# EAGLE design SERVOS-1 (EAGLE 7.2.0)
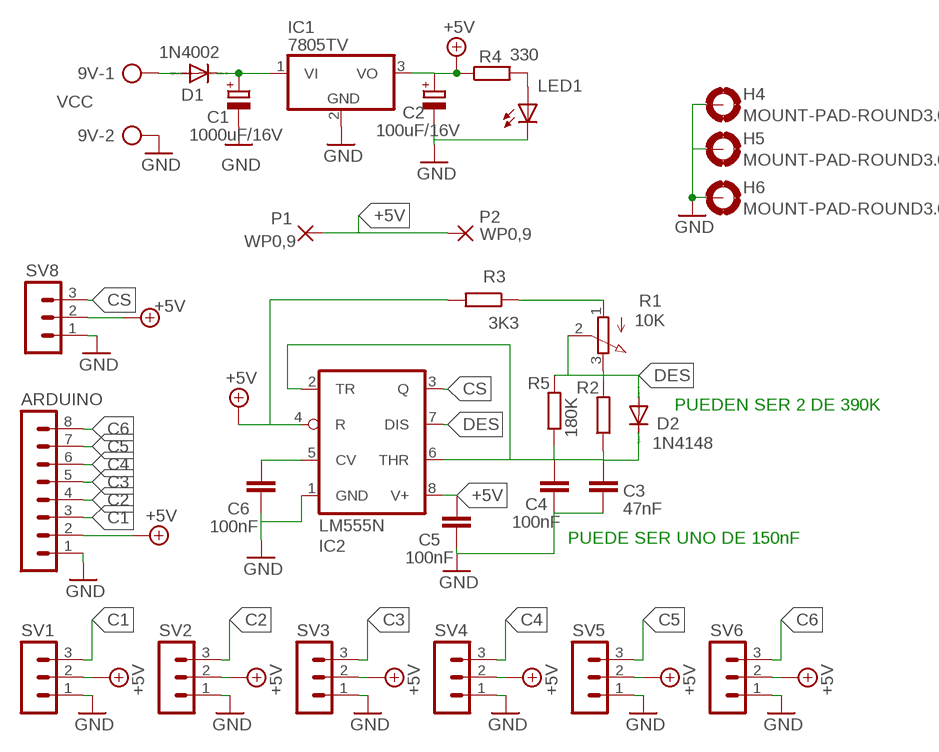
[diagram p0: schematic, sheet 1]

## Parts
9V  VCC  AK500/2  [AK500/2]
ARDUINO  MA08-1  [MA08-1]
C1  1000uF/16V  CPOL-EUE2.5-7  [E2,5-7]
C2  100uF/16V  CPOL-EUE2.5-5  [E2,5-5]
C3  47nF  C-EU050-025X075  [C050-025X075]
C4  100nF  C-EU050-025X075  [C050-025X075]
C5  100nF  C-EU050-025X075  [C050-025X075]
C6  100nF  C-EU050-025X075  [C050-025X075]
D1  1N4002  1N4148DO35-7  [DO35-7]
D2  1N4148  1N4148DO35-7  [DO35-7]
H4  MOUNT-PAD-ROUND3.0  [3,0-PAD]
H5  MOUNT-PAD-ROUND3.0  [3,0-PAD]
H6  MOUNT-PAD-ROUND3.0  [3,0-PAD]
IC1  7805TV  [TO220V]
IC2  LM555N  [DIL08]
LED1  LED3MM  [LED3MM]
P1  WP0,9  WIREPAD1,6/0,9  [1,6/0,9]
P2  WP0,9  WIREPAD1,6/0,9  [1,6/0,9]
R1  10K  3RP/1610N  [3RP/1610N]
R2  R-EU_0207/10  [0207/10]
R3  3K3  R-EU_0207/10  [0207/10]
R4  330  R-EU_0207/10  [0207/10]
R5  180K  R-EU_0207/10  [0207/10]
SV1  MA03-1  [MA03-1]
SV2  MA03-1  [MA03-1]
SV3  MA03-1  [MA03-1]
SV4  MA03-1  [MA03-1]
SV5  MA03-1  [MA03-1]
SV6  MA03-1  [MA03-1]
SV8  MA03-1  [MA03-1]

## Nets
+5V: ARDUINO.2 C2.+ C5.1 IC1.3(VO) IC2.4(R) IC2.8(V+) P1.1(P) P2.1(P) R3.2 R4.1 SV1.2 SV2.2 SV3.2 SV4.2 SV5.2 SV6.2 SV8.2
C1: ARDUINO.3 SV1.3
C2: ARDUINO.4 SV2.3
C3: ARDUINO.5 SV3.3
C4: ARDUINO.6 SV4.3
C5: ARDUINO.7 SV5.3
C6: ARDUINO.8 SV6.3
CS: IC2.3(Q) SV8.3
DES: D2.A IC2.7(DIS) R1.2(S) R1.3(E) R2.2 R5.2
GND: 9V.2 ARDUINO.1 C1.- C2.- C3.2 C4.2 C5.2 C6.2 H4.B3,0(MOUNT) H5.B3,0(MOUNT) H6.B3,0(MOUNT) IC1.2(GND) IC2.1(GND) LED1.K(C) SV1.1 SV2.1 SV3.1 SV4.1 SV5.1 SV6.1 SV8.1
N$1: C1.+ D1.C IC1.1(VI)
N$2: 9V.1 D1.A
N$3: LED1.A R4.2
N$7: C6.1 IC2.5(CV)
N$8: R1.1(A) R3.1
N$9: C3.1 C4.1 D2.C IC2.2(TR) IC2.6(THR) R2.1 R5.1

## Notes on the sheet
- PUEDEN SER 2 DE 390K
- PUEDE SER UNO DE 150nF

## Library data of the parts
9V = con-ptr500:AK500/2: CONNECTOR; OC_FARNELL: unknown; OC_NEWARK: unknown
ARDUINO = con-lstb:MA08-1: PIN HEADER; OC_FARNELL: unknown; OC_NEWARK: unknown
C1 C2 = rcl:CPOL-EU: POLARIZED CAPACITOR, European symbol
C3-C6 = rcl:C-EU: CAPACITOR, European symbol
D1 D2 = diode:1N4148: DIODE high speed (Philips)
H4-H6 = holes:MOUNT-PAD-ROUND: MOUNTING PAD, round
IC1 = linear:78*: Positive VOLTAGE REGULATOR Source: http://cache.national.com/ds/LM/LM78L05.pdf http://www.fairchildsemi.com/ds/LM/LM7805.pdf
IC2 = linear:*555: TIMER
LED1 = led:LED: LED OSRAM: - CHIPLED LG R971, LG N971, LY N971, LG Q971, LY Q971, LO R971, LY R971 LH N974, LH R974 LS Q976, LO Q976, LY Q976 LO Q996 - Hyper CHIPLED LW Q18S LB Q993, LB Q99A, LB R99A - SideLED LS A670, LO A670, LY A670, LG A670, LP A670 LB A673, LV A673, LT A673, LW A673 LH A674 LY A675 LS A676, LA A676, LO A676, LY A676, LW A676 LS A679, LY A679, LG A679 - Hyper Micro SIDELED® LS Y876, LA Y876, LO Y876, LY Y876 LT Y87S - SmartLED LW L88C, LW L88S LB L89C, LB L89S, LG L890 LS L89K, LO L89K, LY L89K LS L896, LA L896, LO L896, LY L896 - TOPLED LS T670, LO T670, LY T670, LG T670, LP T670 LSG T670, LSP T670, LSY T670, LOP T670, LYG T670 LG T671, LOG T671, LSG T671 LB T673, LV T673, LT T673, LW T673 LH T674 LS T676, LA T676, LO T676, LY T676, LB T676, LH T676, LSB T676, LW T676 LB T67C, LV T67C, LT T67C, LS T67K, LO T67K, LY T67K, LW E67C LS E67B, LA E67B, LO E67B, LY E67B, LB E67C, LV E67C, LT E67C LW T67C LS T679, LY T679, LG T679 LS T770, LO T770, LY T770, LG T770, LP T770 LB T773, LV T773, LT T773, LW T773 LH T774 LS E675, LA E675, LY E675, LS T675 LS T776, LA T776, LO T776, LY T776, LB T776 LHGB T686 LT T68C, LB T68C - Hyper Mini TOPLED® LB M676 - Mini TOPLED Santana® LG M470 LS M47K, LO M47K, LY M47K Source: http://www.osram.convergy.de LUXEON: - LUMILED® LXK2-PW12-R00, LXK2-PW12-S00, LXK2-PW14-U00, LXK2-PW14-V00 LXK2-PM12-R00, LXK2-PM12-S00, LXK2-PM14-U00 LXK2-PE12-Q00, LXK2-PE12-R00, LXK2-PE12-S00, LXK2-PE14-T00, LXK2-PE14-U00 LXK2-PB12-K00, LXK2-PB12-L00, LXK2-PB12-M00, LXK2-PB14-N00, LXK2-PB14-P00, LXK2-PB14-Q00 LXK2-PR12-L00, LXK2-PR12-M00, LXK2-PR14-Q00, LXK2-PR14-R00 LXK2-PD12-Q00, LXK2-PD12-R00, LXK2-PD12-S00 LXK2-PH12-R00, LXK2-PH12-S00 LXK2-PL12-P00, LXK2-PL12-Q00, LXK2-PL12-R00 Source: www.luxeon.com KINGBRIGHT: KA-3528ASYC Source: www.kingbright.com
P1 P2 = wirepad:WIREPAD: Wire PAD connect wire on PCB
R1 = pot:3RP/1610N: 16mm Potentiometer one level Source: http://www.alphapotentiometers.net/html/16mm_pot_2.html
R2-R5 = rcl:R-EU_: RESISTOR, European symbol
SV1-SV6 SV8 = con-lstb:MA03-1: PIN HEADER; OC_FARNELL: unknown; OC_NEWARK: unknown

## Board
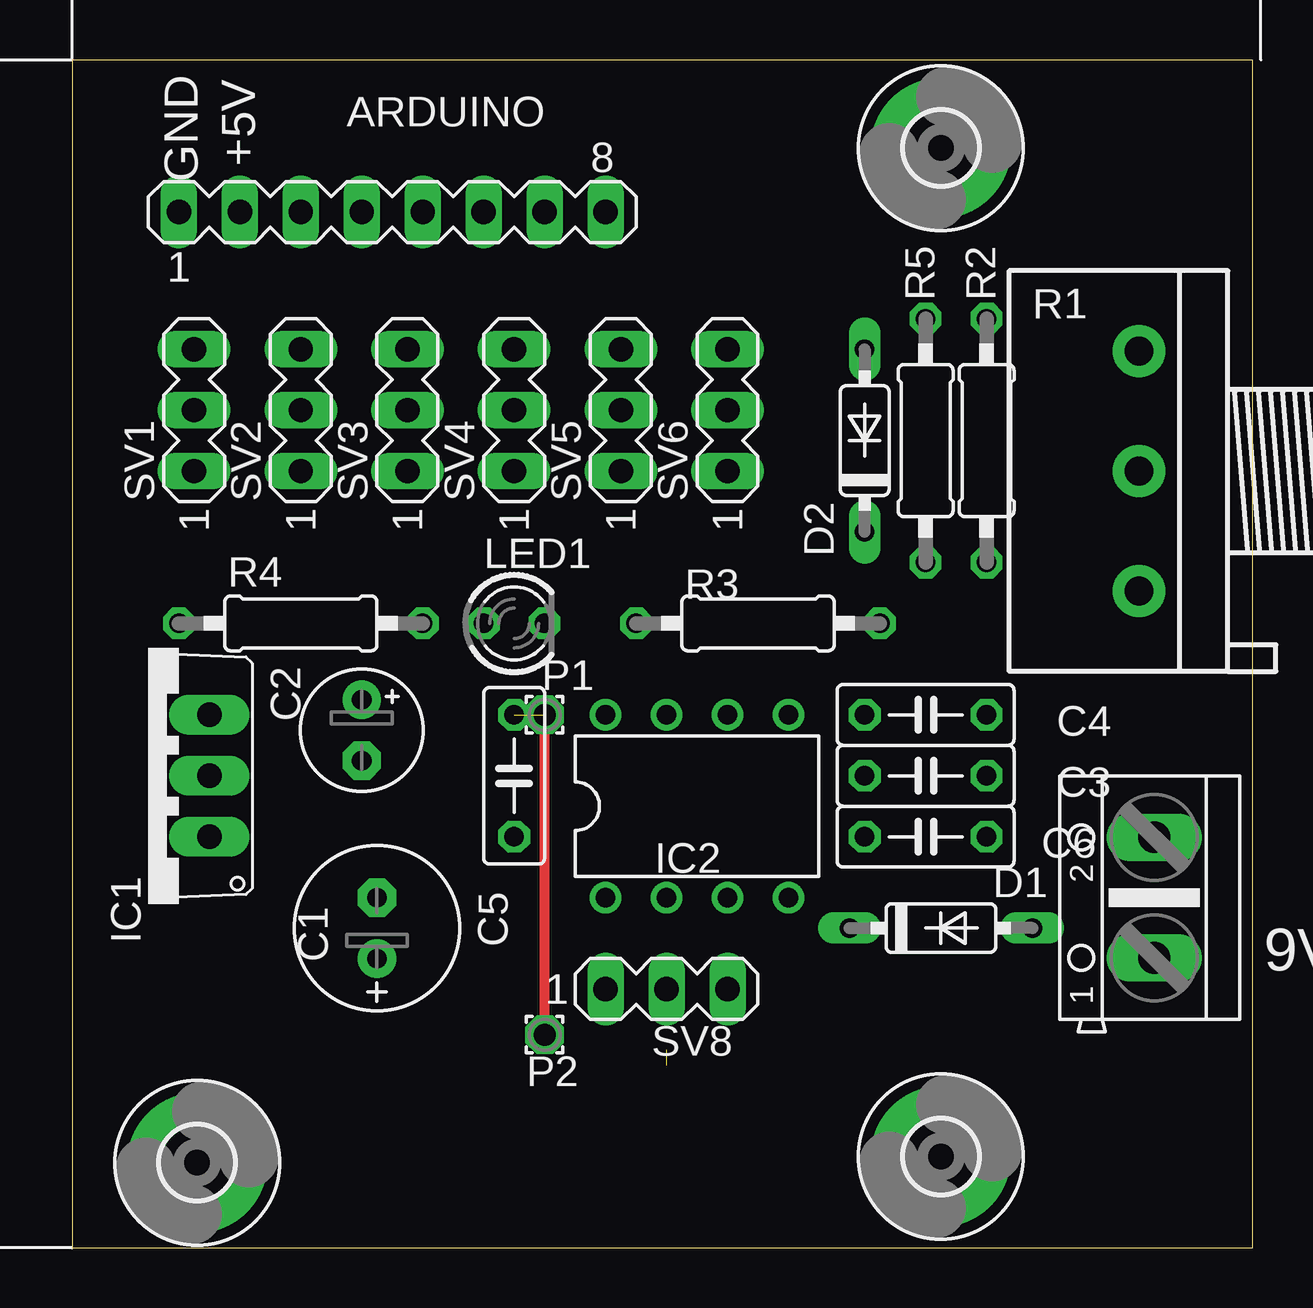
[diagram p1: board, top side]
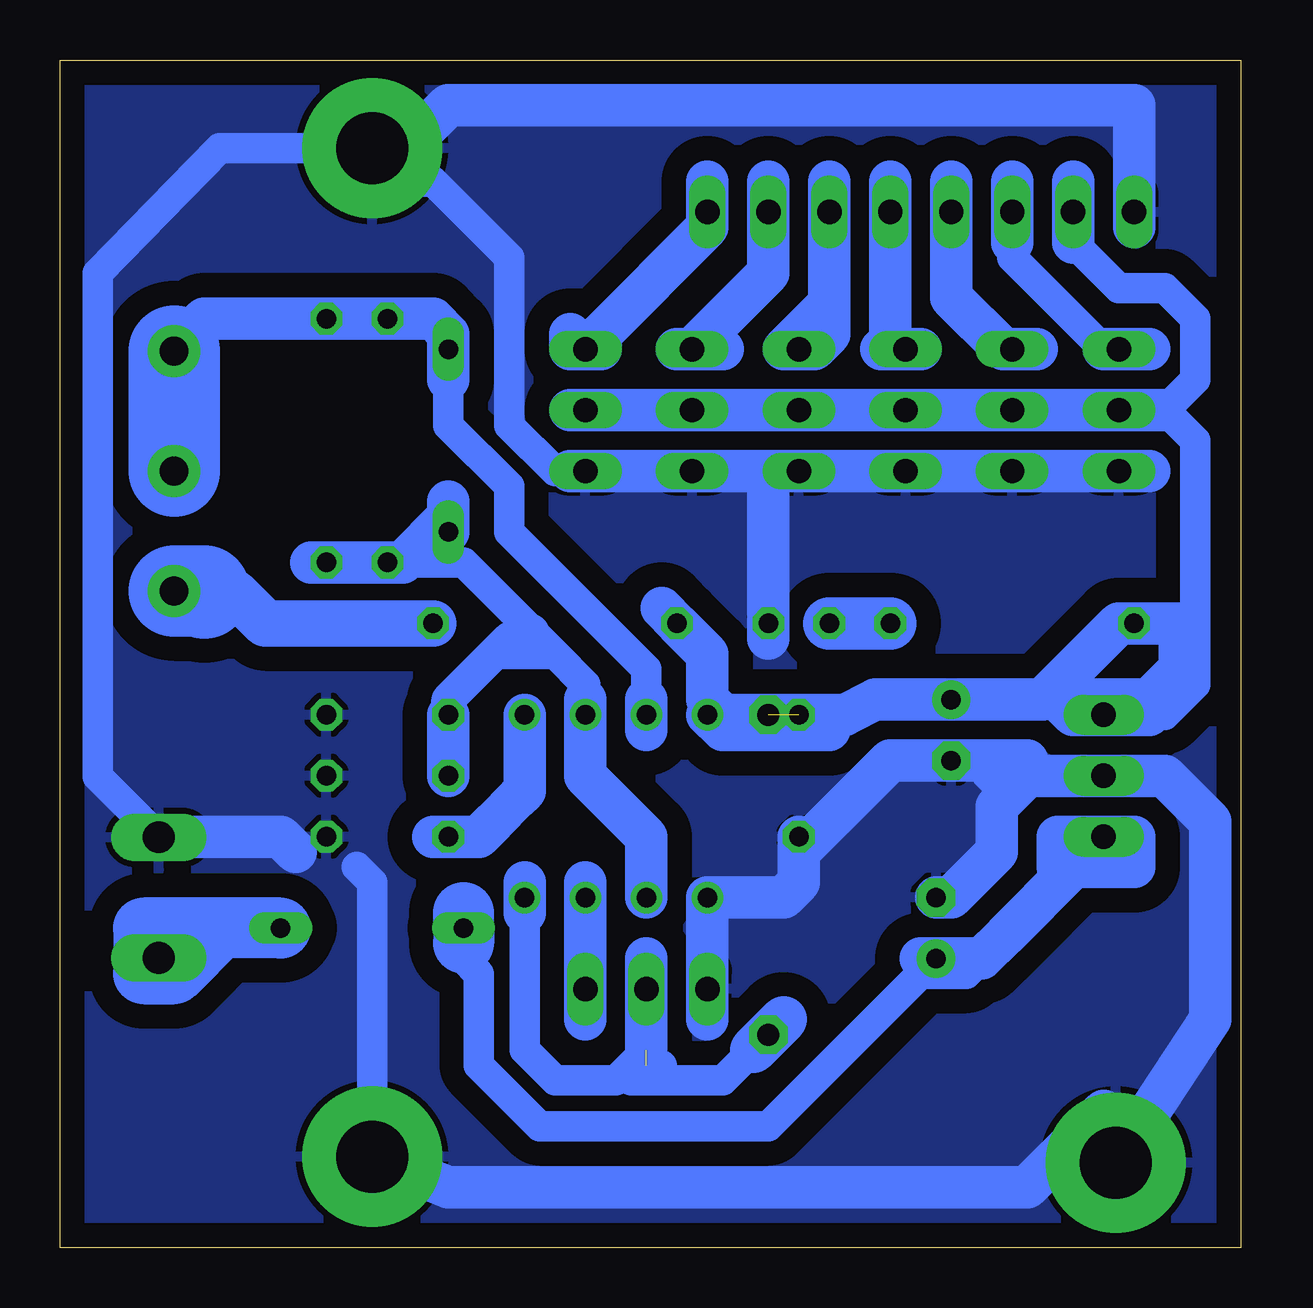
[diagram p2: board, bottom side, seen from below]

Size 49.2 x 49.52 mm. Coordinates in mm from the lower left corner, seen from the top.
Outline: 0,0 49.2,0 49.2,49.52 0,49.52 0,0
Copper layers (1*16): Top 0.035mm / dielectric 1.5mm / Bottom 0.035mm
Design rules "default": minimum track width 10mil, minimum drill 24mil, track to track 8mil, track to pad 8mil, pad to pad 8mil, via to via 8mil, smd to smd 8mil, copper to edge 40mil, drill to drill 8mil, minimum pad ring 10mil, minimum via ring 8mil, stop-mask expansion 4mil, vias tented up to drill 0mil, thermal gap 10mil

### Footprints (pad centres in the part's own frame; a part is rotated, then mirrored left to right if it is on the bottom)
AK500/2 = drill 1.321 long: 1 -2.515,0; 2 2.515,0
MA08-1 = drill 1.016 long: 1 -8.89,0; 2 -6.35,0; 3 -3.81,0; 4 -1.27,0; 5 1.27,0; 6 3.81,0; 7 6.35,0; 8 8.89,0
E2,5-7 = drill 0.813 pad 1.6: + -1.27,0 | drill 0.813 pad 1.6 octagon: - 1.27,0
E2,5-5 = drill 0.813 pad 1.6: + -1.27,0 | drill 0.813 pad 1.6 octagon: - 1.27,0
C050-025X075 = drill 0.813 octagon: 1 -2.54,0; 2 2.54,0
DO35-7 = drill 0.813 long: A 3.81,0; C -3.81,0
3,0-PAD = drill 3 pad 5.842: B3,0 0,0
TO220V = drill 1.016 pad 1.676 long: 1 -2.54,-2.54; 2 0,-2.54; 3 2.54,-2.54
DIL08 = drill 0.813 pad 1.27: 1 -3.81,-3.81; 2 -1.27,-3.81; 3 1.27,-3.81; 4 3.81,-3.81; 5 3.81,3.81; 6 1.27,3.81; 7 -1.27,3.81; 8 -3.81,3.81
LED3MM = drill 0.813 octagon: A -1.27,0; K 1.27,0
1,6/0,9 = drill 0.914 pad 1.6 octagon: 1 0,0
3RP/1610N = drill 1.2 pad 2.184: 1 -5,0; 2 0,0; 3 5,0
0207/10 = drill 0.813 octagon: 1 -5.08,0; 2 5.08,0
MA03-1 = drill 1.016 long: 1 -2.54,0; 2 0,0; 3 2.54,0

### Placement (x,y rotation side)
9V  45.09,14.61 90 top
ARDUINO  13.33,43.18 0 top
C1  12.7,13.34 90 top
C2  12.06,21.59 270 top
C3  35.56,19.68 0 top
C4  35.56,22.22 0 top
C5  18.41,19.68 270 top
C6  35.56,17.14 0 top
D1  36.2,13.34 0 top
D2  33.02,33.66 90 top
H4  36.2,45.85 0 top
H5  36.2,3.81 0 top
H6  5.21,3.56 0 top
IC1  3.17,19.68 90 top
IC2  26.04,18.41 0 top
LED1  18.41,26.04 0 top
P1  19.69,22.22 0 top
P2  19.69,8.89 0 top
R1  44.45,32.39 90 top
R2  38.1,33.66 90 top
R3  28.58,26.04 180 top
R4  9.53,26.04 0 top
R5  35.56,33.66 90 top
SV1  5.08,34.93 90 top
SV2  9.53,34.93 90 top
SV3  13.97,34.93 90 top
SV4  18.41,34.93 90 top
SV5  22.86,34.93 90 top
SV6  27.3,34.93 90 top
SV8  24.77,10.79 0 top

### Tracks (layer width: path | path; a pad name or v marks a point on that pad's centre or on a via)
+5V  (2 unrouted)
  Top 0.406: P2.1 P1.1
  Bottom 1.27: 3.81,22.22 3.17,22.22 1.9,23.49 1.9,33.66 3.17,34.93 1.9,36.2 1.9,38.73 3.17,40.01 5.08,40.01 6.98,41.91 | 24.77,8.89 24.77,8.26 26.04,6.99 28.58,6.99 29.84,8.26 29.84,13.97 | 24.13,7.62 24.77,7.62 25.4,6.99 21.59,6.99 20.32,8.26
  Bottom 1.778: 3.17,34.93 SV1.2 SV2.2 SV3.2 SV4.2 SV5.2 SV6.2 27.94,34.93 | 3.81,22.22 IC1.3 6.98,22.22 7.62,22.86 3.81,22.86 2.54,24.13 2.54,26.04 R4.1 5.08,26.04 8.26,22.86 C2.+ 15.24,22.86 16.51,22.22 21.59,22.22 | 21.59,22.22 IC2.8 21.59,21.59 17.14,21.59 C5.1 | 6.98,44.45 ARDUINO.2 6.98,41.91 | SV8.2 24.77,12.06 | SV8.2 24.77,8.89 | 29.84,13.97 IC2.4 29.84,15.24 | 24.13,26.67 R3.2 22.23,24.76 22.23,22.86 21.59,22.22 | SV8.2 24.77,8.26
  Bottom 1.93: 20.32,8.26 P2.1 19.05,9.53
C1
  Bottom 1.27: 5.71,37.47 9.53,41.27 9.53,41.91
  Bottom 1.778: 3.81,37.47 SV1.3 5.71,37.47 | 9.53,41.91 ARDUINO.3 9.53,44.45
C2
  Bottom 1.778: 12.06,44.45 ARDUINO.4 12.06,39.62 9.91,37.47 SV2.3 8.51,37.47
C3
  Bottom 1.778: 13.33,37.47 SV3.3 14.73,37.47 | 14.6,44.45 ARDUINO.5 14.6,37.59 14.73,37.47 | 14.99,37.47 14.73,37.47
C4
  Bottom 1.778: 17.14,44.45 ARDUINO.6 17.14,39.37 | 17.14,39.37 17.14,38.1 17.78,37.47 SV4.3 19.05,37.47 17.14,39.37
C5
  Bottom 1.778: SV5.3 21.59,37.47 | 23.5,37.47 SV5.3 | SV5.3 19.69,40.64 ARDUINO.7 19.69,44.45
C6
  Bottom 1.778: 22.23,44.45 ARDUINO.8 22.23,42.55 26.67,38.1 26.67,37.47 SV6.3 | SV6.3 27.94,37.47 27.94,38.1 SV6.3
CS
  Bottom 1.778: 27.3,9.53 SV8.3 IC2.3 27.3,15.24
DES
  Bottom 1.27: 33.02,36.2 33.02,34.29 30.48,31.75 30.48,29.84 24.77,24.13 24.77,22.86
  Bottom 1.778: 33.02,36.2 D2.A 33.02,38.1 33.66,38.73 R5.2 R2.2 43.18,38.73 45.09,36.83 45.01,36.83 R1.3 | 24.77,21.59 IC2.7 24.77,22.86
  Bottom 3.81: R1.2 R1.3
GND
  Bottom 1.27: 27.94,32.39 28.58,32.39 30.48,34.29 30.48,41.27 33.66,44.45 35.56,44.45 | H4.B3,0 42.55,45.85 47.62,40.64 47.62,19.66 9V.2 | H5.B3,0 36.2,15.24 36.83,15.88
  Bottom 1.778: C5.2 18.41,16.51 | 18.41,16.51 18.41,15.24 19.05,14.61 IC2.1 SV8.1 22.23,9.53 | 18.41,16.51 14.6,20.32 C2.- 10.79,20.32 | 8.89,19.68 IC1.2 3.17,19.68 1.27,17.78 1.27,9.53 H6.B3,0 5.71,5.71 8.89,2.54 33.02,2.54 H5.B3,0 | 8.89,19.68 10.16,19.68 10.79,20.32 | 10.79,20.32 8.89,20.32 | C1.- 12.06,14.61 10.16,16.51 10.16,18.41 8.89,19.68 | 3.81,32.39 SV1.1 SV2.1 SV3.1 SV4.1 19.69,32.39 | 19.69,32.39 SV5.1 SV6.1 27.94,32.39 | 39.37,16.51 40.01,17.14 45.06,17.14 9V.2 | 4.44,42.55 ARDUINO.1 4.44,47.62 33.02,47.62 36.2,44.45 35.56,44.45 34.93,45.09 H4.B3,0 | 19.69,25.4 LED1.K 19.69,32.39
  pour Bottom (isolate 1.016): 0,0 49.53,0 49.53,49.53 0,49.53
N$1
  Bottom 1.27: 32.38,12.7 32.38,12.06 31.75,11.43 31.75,7.62 29.21,5.08 19.69,5.08 13.33,11.43 11.43,11.43 9.84,13.02
  Bottom 1.778: 6.98,15.88 4.44,15.88 4.44,17.14 IC1.1 7.62,17.14 7.62,15.88 6.98,15.88 | 13.33,12.06 C1.+ 10.79,12.06 9.84,13.02 6.98,15.88
  Bottom 2.54: 32.38,13.97 D1.C 32.38,12.7
N$2
  Bottom 2.54: D1.A 42.55,13.34 | 43.84,13.34 45.72,13.34 45.72,11.43 44.45,11.43 42.55,13.34 | 42.55,13.34 43.84,13.34 | 43.84,13.34 9V.1
N$3
  Bottom 2.184: R4.2 LED1.A
N$7
  Bottom 1.778: IC2.5 29.84,19.05 30.16,18.73 31.12,17.78 31.75,17.14 C6.1 33.66,17.14
N$8
  Bottom 1.93: 43.18,27.3 41.91,27.3 40.64,26.04 R3.1
  Bottom 3.81: R1.1 43.18,27.38 43.18,27.3
N$9
  Bottom 1.27: 31.12,24.76 28.58,24.76 | 28.58,24.76 27.3,23.49 27.3,22.86 | 34.93,28.57 32.38,28.57 29.53,25.72 28.58,24.76
  Bottom 1.422: C4.1 33.02,22.86 30.48,25.4 29.84,25.4 29.53,25.72
  Bottom 1.778: 38.73,28.57 R2.1 R5.1 34.93,28.57 33.02,30.48 D2.C 33.02,31.11 | 27.3,22.86 IC2.6 27.3,19.68 24.77,17.14 IC2.2 | C3.1 C4.1

### Text on the board
tNames: GND | +5V